# Altium schematic sheet CPU.SchDoc
size A4; SheetNumber: 1; SheetTotal: 5
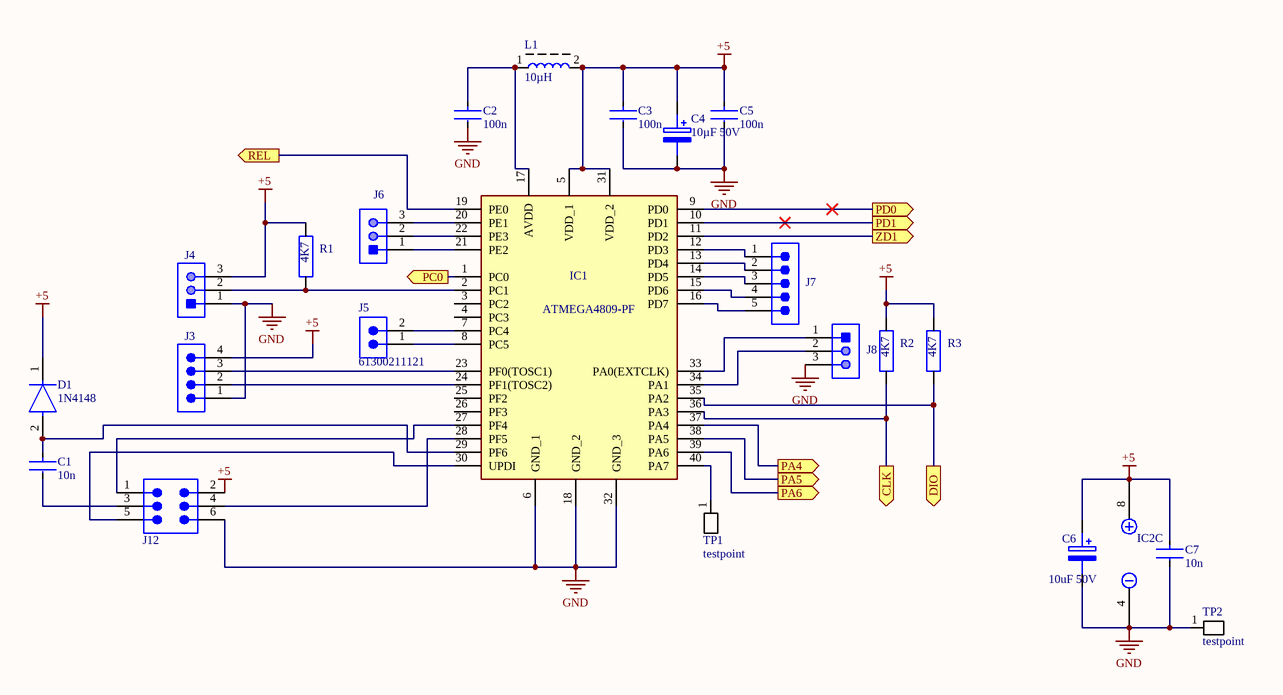
[diagram p0: CPU.SchDoc]

## Parts
C1  10n  [FP-C0805C-DN-IPC_A]
C2  100n  [FP-C0805C-DN-IPC_B]
C3  100n  [FP-C0805C-DN-IPC_A]
C4  10µF 50V  [caprad100mil]
C5  100n  [FP-C0805C-DN-IPC_A]
C6  10uF 50V  [caprad100mil]
C7  10n  [FP-C0805C-DN-IPC_A]
D1  1N4148  [FP-017AG-MFG]
IC1  ATMEGA4809-PF  [DIP1543W58P254L5175H635Q40N]
IC2  MCP6002-E/P  [DIP8PIN]  (value not drawn)  (part C of 3)
J3  61300411121  [61300411121]  (value not drawn)
J4  22-28-4033  [MOLX-22-28-4033_V]  (value not drawn)
J5  61300211121  [61300211121]
J6  22-28-4033  [MOLX-22-28-4033_V]  (value not drawn)
J7  61300511121  [61300511121]  (value not drawn)
J8  22-28-4033  [MOLX-22-28-4033_V]  (value not drawn)
J12  610106249121  [610106249121]  (value not drawn)
L1  10µH  [spoelSMD10µH]
R1  4K7  [res0805ph]
R2  4K7  [res0805ph]
R3  4K7  [res0805ph]
TP1  testpoint  [testpin]
TP2  testpoint  [testpin]

## Ports
CLK (out), DIO (out), PA4 (out), PA5 (out), PA6 (out), PC0 (out), PD0 (out), PD1 (out), REL (out), ZD1 (out)

## Nets
+5: C3.1 C4.1(+) C5.1 C6.1(+) C7.1 D1.1(C) IC1.5(VDD_1) IC1.31(VDD_2) IC2.8 J3.4 J4.3 J12.2 L1.2 R1.1 R2.1 R3.1
GND: C2.2 C3.2 C4.2(-) C5.2 C6.2(-) C7.2 IC1.6(GND_1) IC1.18(GND_2) IC1.32(GND_3) IC2.4 J3.1 J4.1 J8.3 J12.6 TP2.1(TP)
CLK: IC1.36(PA3) R2.2 ; port CLK
DIO: IC1.35(PA2) R3.2 ; port DIO
PA4: IC1.37(PA4) ; port PA4
PA5: IC1.38(PA5) ; port PA5
PA6: IC1.39(PA6) ; port PA6
PC0: IC1.1(PC0) ; port PC0
PD0: IC1.9(PD0) ; port PD0
PD1: IC1.10(PD1) ; port PD1
REL: IC1.19(PE0) ; port REL
ZD1: IC1.11(PD2) ; port ZD1
NetC1_1: C1.1 D1.2(A) IC1.29(PF6)
NetC1_2: C1.2 J12.3
NetC2_1: C2.1 IC1.17(AVDD) L1.1
NetIC1_2: IC1.2(PC1) J4.2 R1.2
NetIC1_7: IC1.7(PC4) J5.2
NetIC1_8: IC1.8(PC5) J5.1
NetIC1_12: IC1.12(PD3) J7.1
NetIC1_13: IC1.13(PD4) J7.2
NetIC1_14: IC1.14(PD5) J7.3
NetIC1_15: IC1.15(PD6) J7.4
NetIC1_16: IC1.16(PD7) J7.5
NetIC1_20: IC1.20(PE1) J6.3
NetIC1_21: IC1.21(PE2) J6.1
NetIC1_22: IC1.22(PE3) J6.2
NetIC1_23: IC1.23(PF0(TOSC1)) J3.3
NetIC1_24: IC1.24(PF1(TOSC2)) J3.2
NetIC1_27: IC1.27(PF4) J12.1
NetIC1_28: IC1.28(PF5) J12.4
NetIC1_30: IC1.30(UPDI) J12.5
NetIC1_33: IC1.33(PA0(EXTCLK)) J8.1
NetIC1_34: IC1.34(PA1) J8.2
NetIC1_40: IC1.40(PA7) TP1.1(TP)

Not connected (* = marked no-connect by the designer): IC1 3(PC2) 4(PC3) 25(PF2) 26(PF3)

## Library data of the parts
C1-C3 C5 C7 = CMP-2007-00259-2: CAP CER 10000PF 200V X7R 0805; Manufacturer Part Number: C0805C103K2RACTU; Manufacturer: KEMET; Material: Ceramic; Temperature Coefficient: 30ppm/°C; Capacitance: 10,000 pF; Tolerance: 0.1; Value: 10,000 pF; Device Class L2: Capacitors; Voltage Rating: 200 V; Temperature Range High: +125°C; ComponentLink2Description: Datasheet; Height: 0.88mm; Octopart: https://octopart.com/c0805c103k2ractu-kemet-9138347; ComponentLink2URL: https://content.kemet.com/datasheets/KEM_C1003_C0G_SMD.pdf; Category: Cap; Temperature: -55°C to +125°C; Temperature Range Low: -55°C; Digikey Description: CAP CER 10000PF 200V X7R 0805; Temperature Characteristic: X7R; Automotive: No; Device Class L3: Ceramic Capacitors; Mouser Description: KEMET - C0805C103K2RACTU - CAP, MLCC, X7R, 10NF, 200V, 0805; RoHS: TRUE; Device Class L1: Passive Components; Lead Free: Yes; Package: C0805C-DN; Ipc Land Pattern Name: CAPC200125X78
C4 C6 = ELCO220uF: Capacitor Polarised; Manufacturer_Name: Kemet; Manufacturer_Part_Number: T494D227K006AT; Datasheet Link: https://datasheet.datasheetarchive.com/originals/distributors/Datasheets-DGA21/1893029.pdf; Height: 3.1mm; Mouser Part Number: 80-T494D227K006; Mouser Price/Stock: https://www.mouser.co.uk/ProductDetail/KEMET/T494D227K006AT/?qs=KZyWKl2lJVCDSHmnBye8LQ%3D%3D
D1 = CMP-07163-000046-1: DIODE GEN PURP 100V 200MA DO35; Forward Voltage: 1V; Max Power Dissipation: 500mW; Max Reverse Current: 5uA; Forward Current: 300mA; Current: 4A; Reverse Recovery Time: 4ns; Element Configuration: Single; Outside Diameter: 1.85mm; Capacitance: 4pF; Polarity: Standard; Max Forward Surge Current (Ifsm): 1A; Reverse Voltage: 100V; Output Current: 200mA; Average Rectified Current: 200mA; Diameter: 1.91mm; Max Repetitive Reverse Voltage (Vrrm): 100V; Current Rating: 200mA; Case/Package: DO-35; Lead Free: Lead Free; Number of Pins: 2; Recovery Time: 4ns; Packaging: Bulk; Contact Plating: Tin; Voltage: 100V; Mount: Through Hole; Max Surge Current: 4A; Package Quantity: 2000; Width: 1.91mm; Max Reverse Voltage (DC): 100V; Length: 4.56mm; Radiation Hardening: No; Power Dissipation: 500mW; Voltage Rating (DC): 100V; Peak Non-Repetitive Surge Current: 4A; REACH SVHC: No SVHC; Height: 4.56mm; Max Operating Temperature: 175°C; Series: -; Weight: 0.01lb; Min Operating Temperature: -65°C
IC1 = ATMEGA4809-PF: Integrated Circuit; Manufacturer_Name: Microchip; Datasheet Link: http://ww1.microchip.com/downloads/en/DeviceDoc/40-pin-Data-Sheet-megaAVR-0-series-DS40002104A.pdf; Height: 6.35mm; Manufacturer_Part_Number: ATMEGA4809-PF; Mouser Part Number: 556-ATMEGA4809-PF; Mouser Price/Stock: https://www.mouser.co.uk/ProductDetail/Microchip-Technology-Atmel/ATMEGA4809-PF?qs=T3oQrply3y9UlpZbCygk%252BQ%3D%3D
IC2 = AMP-OPA-MCP6002-IL8: None; Slew Rate: 0.6V/µs; Supply Current: 100uA; Power Supply Rejection Ratio (PSRR): 86dB; Input Offset Voltage (Vos): 4.5mV; Input Bias Current: 1pA; Amplifier Type: GENERAL PURPOSE; Unity Gain Bandwidth Product: 1MHz; Number of Circuits: 2; Output Current: 23mA; Operating Supply Voltage: 5.5V; Min Supply Voltage: 1.8V; Common Mode Rejection Ratio: 60dB; Voltage Gain: 112dB; Max Supply Voltage: 6V; Package Quantity: 60; REACH SVHC: No SVHC; Min Operating Temperature: -40°C; Max Operating Temperature: 125°C; Mount: Through Hole; Nominal Supply Current: 100uA; Height: 3.3mm; Length: 9.27mm; Slew Rate-Nom: 0.6V/µs; Packaging: Rail/Tube; Output Current per Channel: 23mA; Number of Amplifiers: 2; RoHS Compliant: Yes; Radiation Hardening: No; Bandwidth: 1MHz; Lead Free: Lead Free; Width: 6.35mm; Number of Channels: 2; Gain Bandwidth Product: 1MHz; Technology: CMOS; Operating Supply Current: 100uA; Number of Elements: 2; Number of Pins: 8; Input Offset Voltage-Max: 4.5mV; Case/Package: PDIP
J3 = CMP-1502-01064-2: NexarPartId: 32855522; Gender: Male; Contact Resistance: 20mΩ; Pitch: 2.54mm; Number of Contacts: 4; Current Rating: 3A; Connector Type: Male Pin; Voltage Rating: 250V; Packaging: Bulk; Orientation: Vertical; Lead Free: Lead Free; Contact Plating: Gold; Max Operating Temperature: 105°C; Height: 8.89mm; Contact Mating Length: 5.9944mm; Contact Material: Copper; Lead Pitch: 2.54mm; Min Operating Temperature: -40°C; Termination: Solder; Color: Black; Number of Rows: 1; REACH SVHC: Unknown; RoHS: Compliant; Mount: Through Hole; Number of Positions: 4; Number of Pins: 4; Operating Supply Voltage: 250V
J4 J6 J8 = CMP-1676-00001-5: Male Header, Pitch 2.54 mm, 1 x 3 Position, Height 8.38 mm, Tail Length 3.18 mm, RoHS, Bulk; Manufacturer: Molex; Rows: 1; Voltage Rating: 250 V; Current Rating: 4 A; Min Operating Temperature: 0 degC; Lead Pitch: 0.1 inch; Packaging: Bulk; Contact Finish: Gold; RoHSCompliant: true; Contact Material: Brass; PackageReference: 22-28-4033; REACH SVHC: Unknown; PackageDescription: Male Header, Pitch 2.54 mm, 1 x 3 Position, Height 8.38 mm, Tail Length 3.18 mm; ComponentLink2URL: http://www.molex.com/pdm_docs/sd/022284033_sd.pdf; Height: 8.38 mm; Mounting Technology: Through Hole; ComponentLink1Description: Manufacturer URL; Length: 7.62 mm; Mount: Through Hole; DatasheetVersion: Rev. G, 01/2012; Max Operating Temperature: 75 degC; ComponentLink2Description: Datasheet; Colour: Black; Pins: 3; Contact Plating: Gold; Package Quantity: 1; ComponentLink1URL: http://www.molex.com/
J5 = CMP-1712-00002-5: NexarPartId: 20081794; Gender: Male; Pitch: 2.54mm; Contact Resistance: 20mΩ; Operating Supply Voltage: 250V; Current Rating: 3A; Number of Contacts: 2; Connector Type: Male Pin; Orientation: Vertical; Packaging: Bulk; Contact Plating: Gold; Contact Material: Copper; Number of Pins: 2; Min Operating Temperature: -40°C; Lead Pitch: 2.54mm; Mount: Through Hole; RoHS: Compliant; REACH SVHC: No SVHC; Height: 8.94mm; Termination: Through Hole; Number of Positions: 2; Contact Mating Length: 5.9944mm; Color: Black; Contact Gender: Male; Number of Rows: 1; Housing Material: PBT; Lead Free: Lead Free; Voltage Rating: 250V; Max Operating Temperature: 125°C
J7 = CMP-1502-01068-2: NexarPartId: 32855526; Contact Resistance: 20mΩ; Pitch: 2.54mm; Gender: Male; Operating Supply Voltage: 250V; Number of Contacts: 5; Connector Type: Male Pin; Current Rating: 3A; Orientation: Vertical; Packaging: Bulk; Termination: Solder; RoHS: Compliant; Lead Pitch: 2.54mm; Contact Mating Length: 5.9944mm; Number of Positions: 5; Lead Free: Lead Free; Contact Plating: Gold; Number of Pins: 5; Min Operating Temperature: -40°C; Voltage Rating: 250V; Color: Black; Mount: Through Hole; REACH SVHC: Unknown; Height: 8.89mm; Number of Rows: 1; Contact Material: Copper; Max Operating Temperature: 105°C
J12 = CMP-1502-01146-2: NexarPartId: 52645089; Contact Resistance: 20mΩ; Gender: Male; Pitch: 2.54mm; Connector Type: Male Pin; Number of Contacts: 6; Current Rating: 3A; Operating Supply Voltage: 250V; Packaging: Tape and Reel; Contact Plating: Gold; Mount: Surface Mount; RoHS: Compliant; REACH SVHC: Unknown; Lead Pitch: 2.54mm; Termination: Solder; Color: Black; Contact Mating Length: 5.9944mm; Number of Positions: 6; Number of Rows: 2; Number of Pins: 6; Row Spacing: 2.54mm
L1 = Spoel_1
R1-R3 = Res: Resistor; Manufacturer_Name: TE Connectivity; Manufacturer_Part_Number: CPF0201D10K2C1; Datasheet Link: http://www.te.com/commerce/DocumentDelivery/DDEController?Action=showdoc&DocId=Data+Sheet%7F1773200-1%7FA%7Fpdf%7FEnglish%7FENG_DS_1773200-1_A.pdf%7F4-2176215-6; Height: 0.28mm; Mouser Part Number: N/A; Mouser Price/Stock: https://www.mouser.com/Search/Refine.aspx?Keyword=N%2FA